# EAGLE design midi-in (EAGLE 9.4.2)
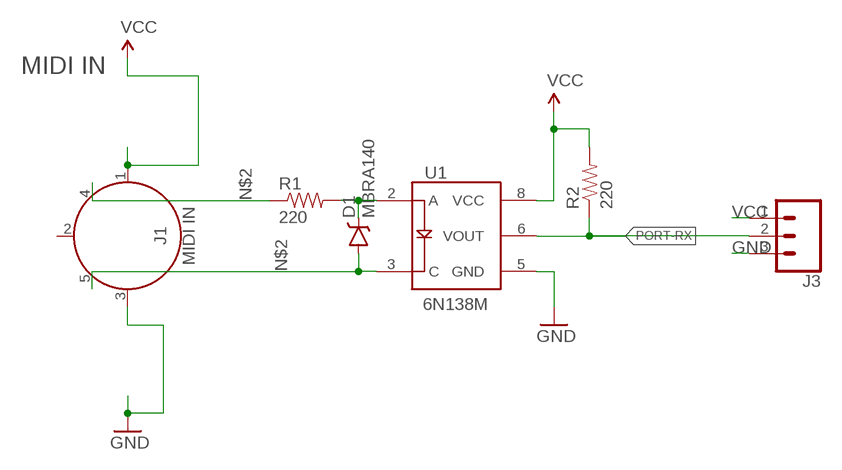
[diagram p0: schematic, sheet 1]

## Parts
D1  MBRA140  [SMA-DIODE]
J1  MIDI IN  5-PIN-CIRCULAR-DINNEW  [5-PIN-DIN-RA-PCB-NEW]
J3  CONN_03  [1X03]
R1  220  220OHM-1/10W-1%(0603)  [0603-RES]
R2  220  220OHM-1/10W-1%(0603)  [0603-RES]
U1  6N138M  OPTO_DARL_6N138S  [8-SMD]

## Nets
56: D1.C R1.2 U1.2(A)
GND: J1.3 J3.3 U1.5(GND)
N$2: J1.4 R1.1
PIN5: D1.A J1.5 U1.3(C)
PORT-RX: J3.2 R2.1 U1.6(VOUT)
VCC: J1.1 J3.1 R2.2 U1.8(VCC)
Unconnected: J1.2

## Notes on the sheet
- MIDI IN

## Library data of the parts
D1 = SparkFun-DiscreteSemi:MBRA140: 40V, 1A Schottky rectifier SMA/DO-214AC package DIO-08053; PROD_ID: DIO-08053
J1 = Testing:5-PIN-CIRCULAR-DIN: 5-pin circular DIN connector. Fillsize variant is frequently used as a MIDI jack; PROD_ID: CONN-09481
J3 = SparkFun-Connectors:CONN_03: Multi connection point. Often used as Generic Header-pin footprint for 0.1 inch spaced/style header connections On any of the 0.1 inch spaced packages, you can populate with these: Break Away Headers - Straight <https://www.sparkfun.com/products/116> (PRT-00116) Break Away Male Headers - Right Angle <https://www.sparkfun.com/products/553> (PRT-00553) Female Headers <https://www.sparkfun.com/products/115> (PRT-00115) Break Away Headers - Machine Pin <https://www.sparkfun.com/products/117> (PRT-00117) Break Away Female Headers - Swiss Machine Pin <https://www.sparkfun.com/products/743> (PRT-00743) Stackable Header - 3 Pin (Female, 0.1") <https://www.sparkfun.com/products/13875> (PRT-13875) For SCREWTERMINALS and SPRING TERMINALS visit here: Screw Terimnals on SparkFun.com <https://www.sparkfun.com/search/results?term=Screw+Terminals> (5mm/3.5mm/2.54mm spacing) This device is also useful as a general connection point to wire up your design to another part of your project. Our various solder wires solder well into these plated through hole pads. Hook-Up Wire - Assortment (Stranded, 22 AWG) <https://www.sparkfun.com/products/11375> (PRT-11375) Hook-Up Wire - Assortment (Solid Core, 22 AWG) <https://www.sparkfun.com/products/11367> (PRT-11367) View the entire wire category on our website here <https://www.sparkfun.com/categories/141> Special notes: Molex polarized connector foot print use with SKU : PRT-08232 with associated crimp pins and housings.
R1 R2 = SparkFun-Resistors:220OHM-1/10W-1%(0603): RES-07861; PROD_ID: RES-07861
U1 = SparkFun-DiscreteSemi:OPTO_DARL_6N138S: Optoisolator, darlington pair output; PROD_ID: IC-09482

## Board
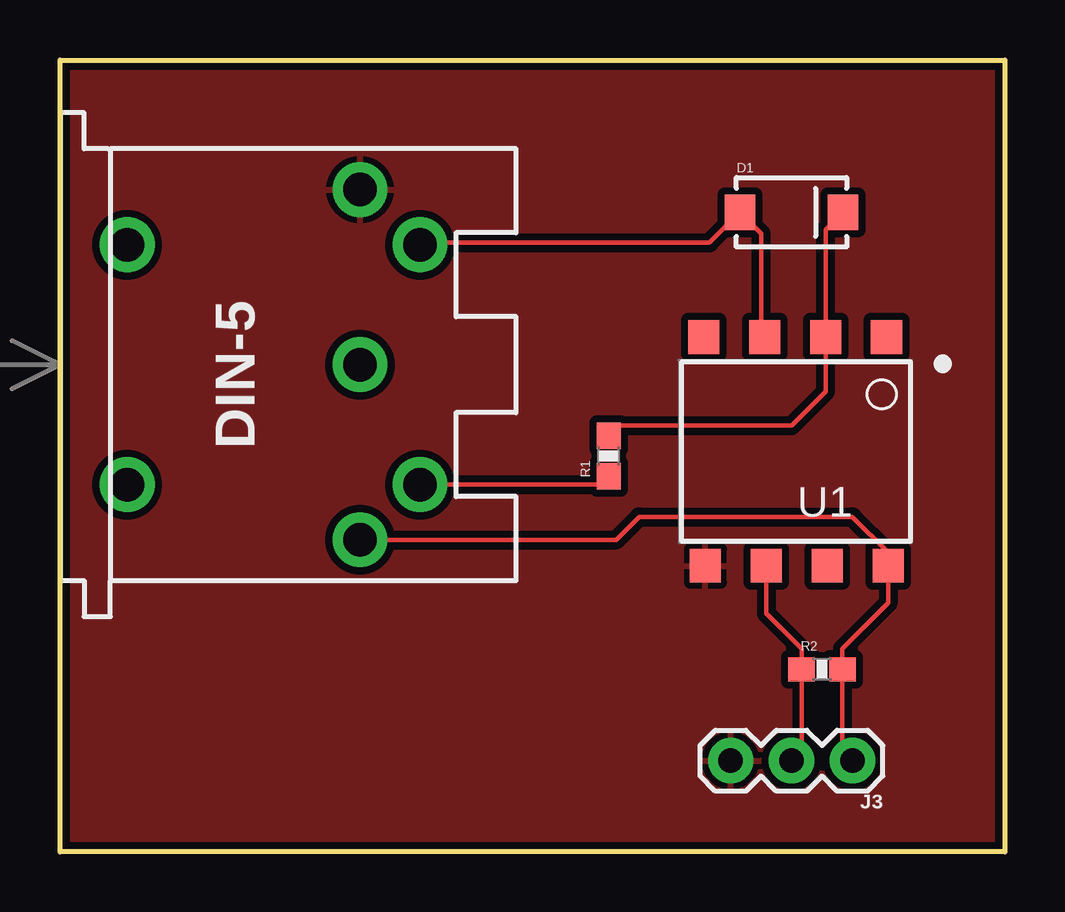
[diagram p1: board, top side]
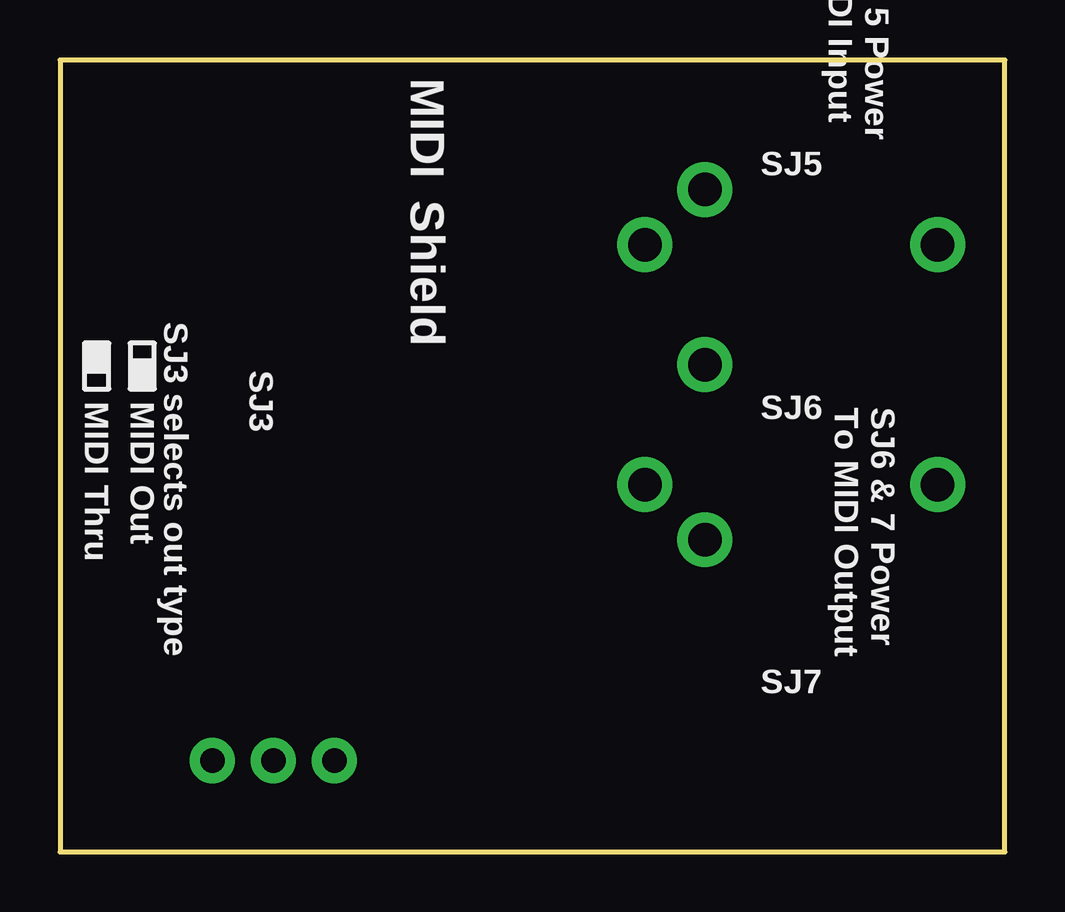
[diagram p2: board, bottom side, seen from below]

Size 39.37 x 33.02 mm. Coordinates in mm from the lower left corner, seen from the top.
Outline: 0,0 0,33.02 39.37,33.02 39.37,0 0,0
Copper layers (1+2*16): Top 0.035mm / dielectric 1.5mm / Route2 0.035mm / dielectric 0.15mm / Bottom 0.035mm
Design rules "SparkFun-2-layer *": minimum track width 7mil, minimum drill 15mil, track to track 8mil, track to pad 8mil, pad to pad 8mil, via to via 8mil, smd to smd 8mil, copper to edge 8mil, drill to drill 8mil, minimum pad ring 12mil, minimum via ring 10mil, stop-mask expansion 4mil, vias tented up to drill 20mil, thermal gap 10mil

### Footprints (pad centres in the part's own frame; a part is rotated, then mirrored left to right if it is on the bottom)
SMA-DIODE = smd 1.27 x 1.47: A -2.15,0; C 2.15,0
5-PIN-DIN-RA-PCB-NEW = drill 1.4 pad 2.286: 1 7.3,12.5; 2 0,12.5; 3 -7.3,12.5; 4 5,15; 5 -5,15; 6 -5,2.8; 7 5,2.8
1X03 = drill 1.016 pad 1.88: 1 0,0; 2 2.54,0; 3 5.08,0
0603-RES = smd 1.1 x 1: 1 -0.85,0; 2 0.85,0
8-SMD = smd 1.3 x 1.4: 1 -3.96,-4.96; 2 -1.42,-4.96; 3 1.12,-4.96; 4 3.66,-4.96; 5 3.59,4.58; 6 1.05,4.58; 7 -1.49,4.58; 8 -4.03,4.58

### Placement (x,y rotation side)
D1  30.48,26.67 0 top
J1  0,20.32 270 top
J3  33.02,3.81 180 top
R1  22.86,16.51 90 top
R2  31.75,7.62 0 top
U1  30.48,16.51 180 top

### Tracks (layer width: path | path; a pad name or v marks a point on that pad's centre or on a via)
56
  Top 0.178: D1.C 31.9,25.94 U1.2 31.9,19.2 30.48,17.78 23.28,17.78 R1.2
GND
  pour Top (isolate 0.305): 0,33.02 39.37,33.02 39.37,0 0,0
N$2
  Top 0.178: J1.4 22.52,15.32 R1.1
PIN5
  Top 0.178: J1.5 15.08,25.4 27.06,25.4 D1.A 29.21,25.79 29.21,21.62 U1.3
PORT-RX
  Top 0.178: U1.6 29.43,9.94 30.9,8.47 R2.1 30.9,4.23 J3.2
VCC
  Top 0.178: J1.1 23.18,13.02 24.13,13.97 33.02,13.97 34.51,12.48 U1.8 34.51,10.38 32.6,8.47 R2.2 32.6,4.23 J3.1

### Text on the board
bPlace: SJ1&2 select UART | SJ2 | SJ1 | Hardware (0,1) | Software (8,9) | SJ4 | SJ4 & 5 Power / To MIDI Input | MIDI | SJ5 | Shield | SJ3 selects out type | SJ6 & 7 Power / To MIDI Output | SJ6 | SJ3 | MIDI Out | MIDI Thru | SJ7
Measures: 5-pin DIN connectors need approx / 0.53" (13.5mm) diam holes | Pot shafts are 0.24" (6mm) diameter | All units in Inches
tDocu: Chris Taylor | Byron Jacquot